# Altium schematic sheet Wavefolder.SchDoc
size B
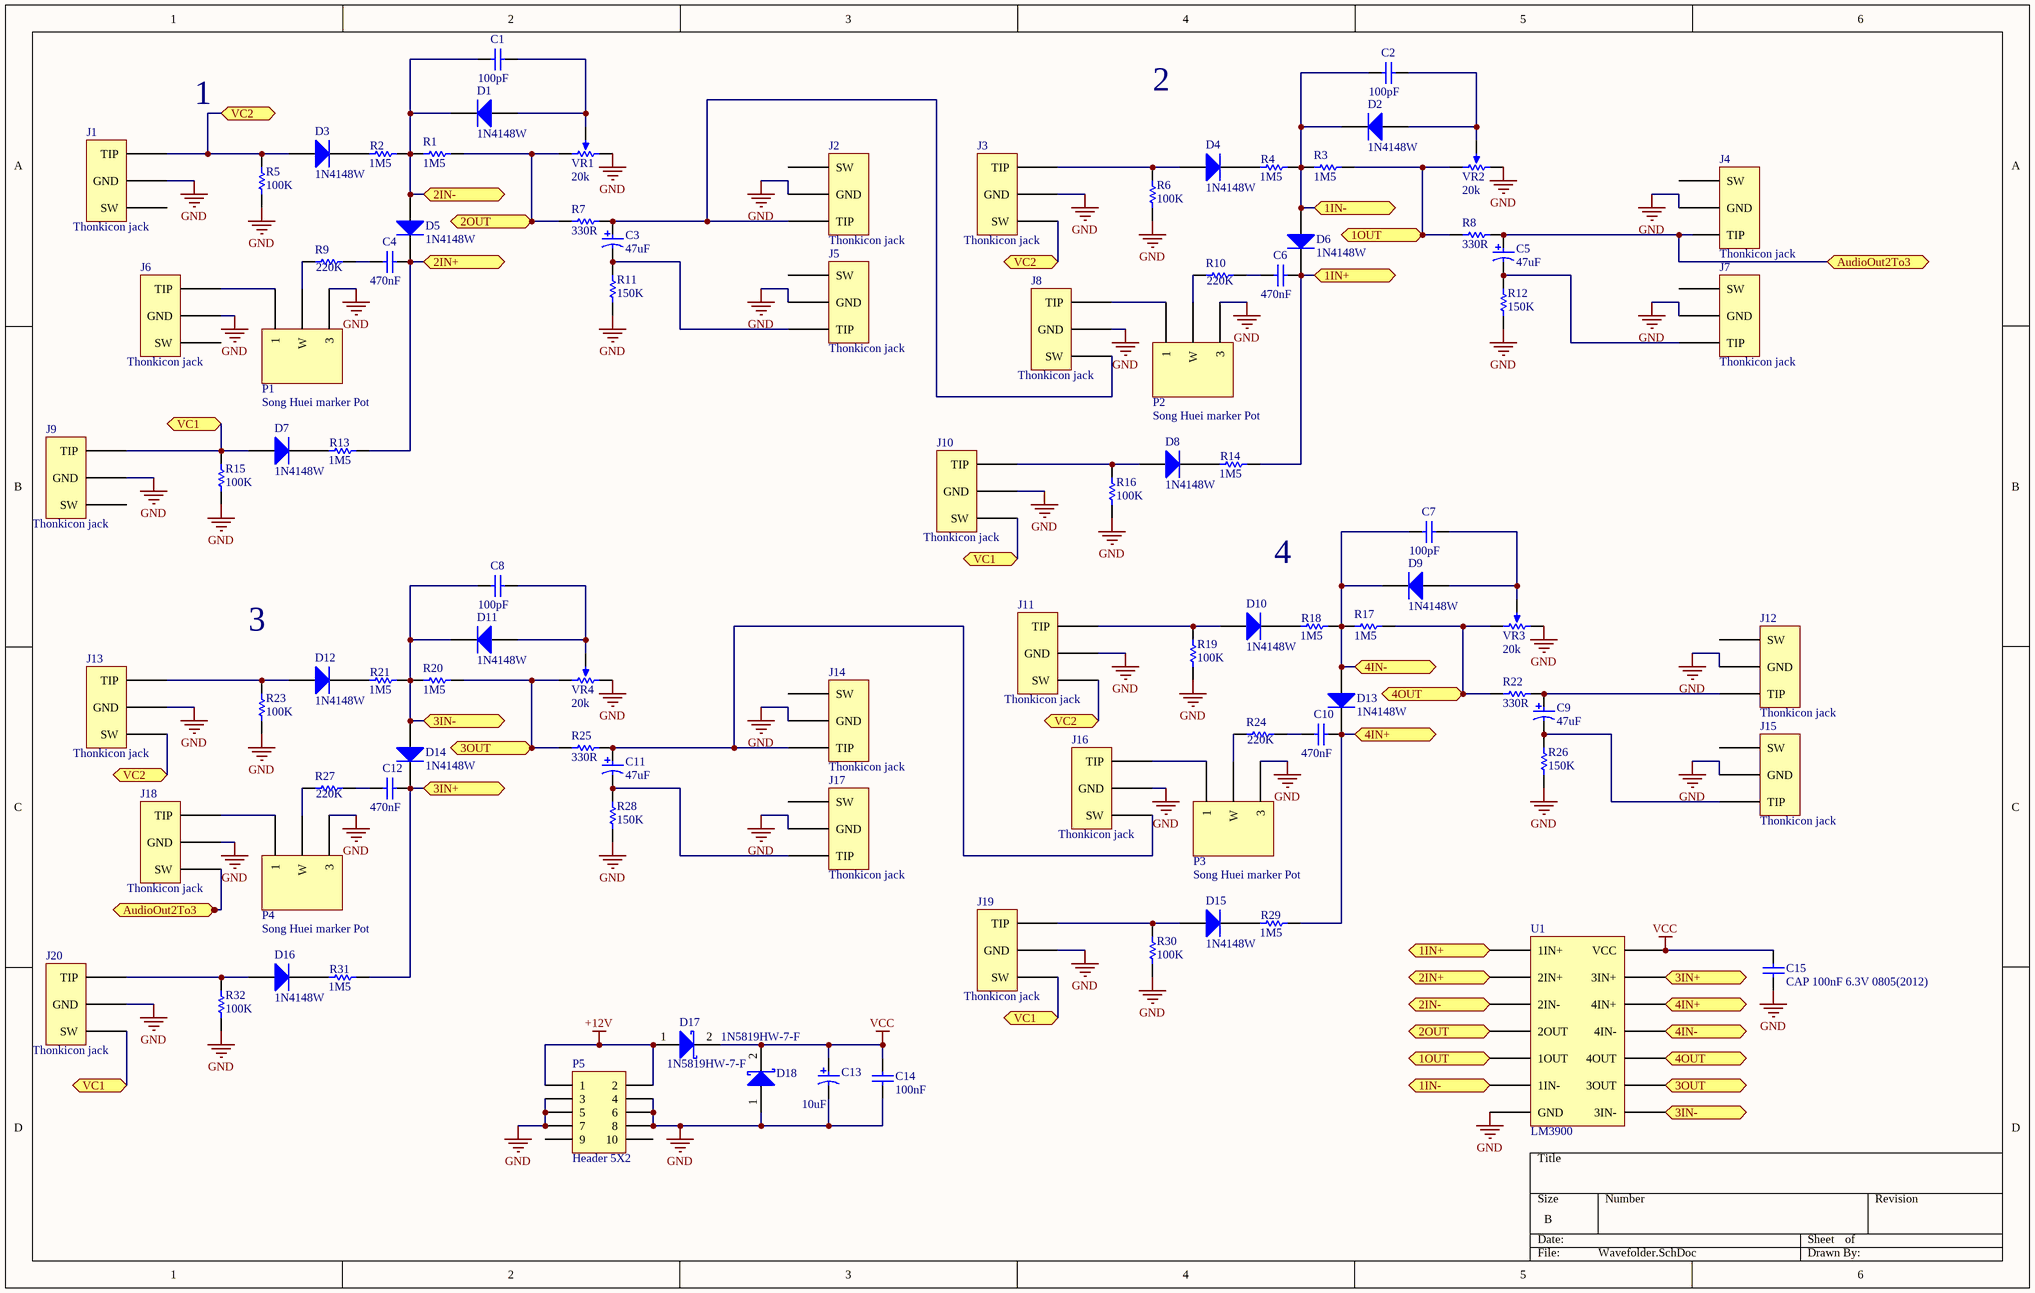
[diagram p0: Wavefolder.SchDoc]

## Parts
C1  100pF  [CAPC0805(2012)75_N]
C2  100pF  [CAPC0805(2012)75_N]
C3  47uF  [PNSC-FT-V-53x53-2_V]
C4  470nF  [CAPC0805(2012)75_N]
C5  47uF  [PNSC-FT-V-53x53-2_V]
C6  470nF  [CAPC0805(2012)75_N]
C7  100pF  [CAPC0805(2012)75_N]
C8  100pF  [CAPC0805(2012)75_N]
C9  47uF  [PNSC-FT-V-53x53-2_V]
C10  470nF  [CAPC0805(2012)75_N]
C11  47uF  [PNSC-FT-V-53x53-2_V]
C12  470nF  [CAPC0805(2012)75_N]
C13  10uF  [NIC-CAPA2-4X5.8_V]
C14  100nF  [CAPC0805(2012)75_N]
C15  CAP 100nF 6.3V 0805(2012)  [CAPC0805(2012)100_N]
D1  1N4148W  [JSCJ-SOD-123-2_V]
D2  1N4148W  [JSCJ-SOD-123-2_V]
D3  1N4148W  [JSCJ-SOD-123-2_V]
D4  1N4148W  [JSCJ-SOD-123-2_V]
D5  1N4148W  [JSCJ-SOD-123-2_V]
D6  1N4148W  [JSCJ-SOD-123-2_V]
D7  1N4148W  [JSCJ-SOD-123-2_V]
D8  1N4148W  [JSCJ-SOD-123-2_V]
D9  1N4148W  [JSCJ-SOD-123-2_V]
D10  1N4148W  [JSCJ-SOD-123-2_V]
D11  1N4148W  [JSCJ-SOD-123-2_V]
D12  1N4148W  [JSCJ-SOD-123-2_V]
D13  1N4148W  [JSCJ-SOD-123-2_V]
D14  1N4148W  [JSCJ-SOD-123-2_V]
D15  1N4148W  [JSCJ-SOD-123-2_V]
D16  1N4148W  [JSCJ-SOD-123-2_V]
D17  1N5819HW-7-F  [DIOD-SOD-123-2_V]
D18  1N5819HW-7-F  [DIOD-SOD-123-2_V]
J1  Thonkicon jack  [Thonkiconn Pot PJ301M]
J2  Thonkicon jack  [Thonkiconn Pot PJ301M]
J3  Thonkicon jack  [Thonkiconn Pot PJ301M]
J4  Thonkicon jack  [Thonkiconn Pot PJ301M]
J5  Thonkicon jack  [Thonkiconn Pot PJ301M]
J6  Thonkicon jack  [Thonkiconn Pot PJ301M]
J7  Thonkicon jack  [Thonkiconn Pot PJ301M]
J8  Thonkicon jack  [Thonkiconn Pot PJ301M]
J9  Thonkicon jack  [Thonkiconn Pot PJ301M]
J10  Thonkicon jack  [Thonkiconn Pot PJ301M]
J11  Thonkicon jack  [Thonkiconn Pot PJ301M]
J12  Thonkicon jack  [Thonkiconn Pot PJ301M]
J13  Thonkicon jack  [Thonkiconn Pot PJ301M]
J14  Thonkicon jack  [Thonkiconn Pot PJ301M]
J15  Thonkicon jack  [Thonkiconn Pot PJ301M]
J16  Thonkicon jack  [Thonkiconn Pot PJ301M]
J17  Thonkicon jack  [Thonkiconn Pot PJ301M]
J18  Thonkicon jack  [Thonkiconn Pot PJ301M]
J19  Thonkicon jack  [Thonkiconn Pot PJ301M]
J20  Thonkicon jack  [Thonkiconn Pot PJ301M]
P1  Song Huei marker Pot  [SonGueiPot]
P2  Song Huei marker Pot  [SonGueiPot]
P3  Song Huei marker Pot  [SonGueiPot]
P4  Song Huei marker Pot  [SonGueiPot]
P5  Header 5X2  [HDR2X5]
R1  1M5  [RESC0805(2012)_N]
R2  1M5  [RESC0805(2012)_N]
R3  1M5  [RESC0805(2012)_N]
R4  1M5  [RESC0805(2012)_N]
R5  100K  [RESC0805(2012)_L]
R6  100K  [RESC0805(2012)_L]
R7  330R  [RESC0805(2012)_L]
R8  330R  [RESC0805(2012)_L]
R9  220K  [RESC0805(2012)_N]
R10  220K  [RESC0805(2012)_N]
R11  150K  [RESC0805(2012)_N]
R12  150K  [RESC0805(2012)_N]
R13  1M5  [RESC0805(2012)_N]
R14  1M5  [RESC0805(2012)_N]
R15  100K  [RESC0805(2012)_L]
R16  100K  [RESC0805(2012)_L]
R17  1M5  [RESC0805(2012)_N]
R18  1M5  [RESC0805(2012)_N]
R19  100K  [RESC0805(2012)_L]
R20  1M5  [RESC0805(2012)_N]
R21  1M5  [RESC0805(2012)_N]
R22  330R  [RESC0805(2012)_L]
R23  100K  [RESC0805(2012)_L]
R24  220K  [RESC0805(2012)_N]
R25  330R  [RESC0805(2012)_L]
R26  150K  [RESC0805(2012)_N]
R27  220K  [RESC0805(2012)_N]
R28  150K  [RESC0805(2012)_N]
R29  1M5  [RESC0805(2012)_N]
R30  100K  [RESC0805(2012)_L]
R31  1M5  [RESC0805(2012)_N]
R32  100K  [RESC0805(2012)_L]
U1  LM3900  [LM3900]
VR1  20k  [BOUR-3006P-3_V]
VR2  20k  [BOUR-3006P-3_V]
VR3  20k  [BOUR-3006P-3_V]
VR4  20k  [BOUR-3006P-3_V]

## Ports
1IN+, 1IN-, 1OUT, 2IN+, 2IN-, 2OUT, 3IN+, 3IN-, 3OUT, 4IN+, 4IN-, 4OUT, AudioOut2To3, VC1, VC2

## Nets
+12V: D17.1(A) P5.1 P5.2
GND: C13.2 C14.1 C15.1 D18.1(A) J1.1(GND) J2.1(GND) J3.1(GND) J4.1(GND) J5.1(GND) J6.1(GND) J7.1(GND) J8.1(GND) J9.1(GND) J10.1(GND) J11.1(GND) J12.1(GND) J13.1(GND) J14.1(GND) J15.1(GND) J16.1(GND) J17.1(GND) J18.1(GND) J19.1(GND) J20.1(GND) P1.3 P2.3 P3.3 P4.3 P5.3 P5.4 P5.5 P5.6 P5.7 P5.8 R5.1 R6.1 R11.1 R12.1 R15.1 R16.1 R19.1 R23.1 R26.1 R28.1 R30.1 R32.1 U1.7(GND) VR1.3(CW) VR2.3(CW) VR3.3(CW) VR4.3(CW)
VCC: C13.1 C14.2 C15.2 D17.2(K) D18.2(K) U1.14(VCC)
1IN+: C6.2 D6.2(-) R14.2 U1.1(1IN+) ; port 1IN+
1IN-: C2.1 D2.2(-) D6.1(+) R3.1 R4.2 U1.6(1IN-) ; port 1IN-
1OUT: R3.2 R8.1 U1.5(1OUT) VR2.1(CCW) ; port 1OUT
2IN+: C4.2 D5.2(-) R13.2 U1.2(2IN+) ; port 2IN+
2IN-: C1.1 D1.2(-) D5.1(+) R1.1 R2.2 U1.3(2IN-) ; port 2IN-
2OUT: R1.2 R7.1 U1.4(2OUT) VR1.1(CCW) ; port 2OUT
3IN+: C12.2 D14.2(-) R31.2 U1.13(3IN+) ; port 3IN+
3IN-: C8.1 D11.2(-) D14.1(+) R20.1 R21.2 U1.8(3IN-) ; port 3IN-
3OUT: R20.2 R25.1 U1.9(3OUT) VR4.1(CCW) ; port 3OUT
4IN+: C10.2 D13.2(-) R29.2 U1.12(4IN+) ; port 4IN+
4IN-: C7.1 D9.2(-) D13.1(+) R17.1 R18.2 U1.11(4IN-) ; port 4IN-
4OUT: R17.2 R22.1 U1.10(4OUT) VR3.1(CCW) ; port 4OUT
AudioOut2To3: C5.1 J4.3(TIP) J18.2(SW) R8.2 ; port AudioOut2To3
VC1: D7.1(+) J9.3(TIP) J10.2(SW) J19.2(SW) J20.2(SW) R15.2 ; port VC1
VC2: D3.1(+) J1.3(TIP) J3.2(SW) J11.2(SW) J13.2(SW) R5.2 ; port VC2
NetC1_2: C1.2 D1.1(+) VR1.2(WIPER)
NetC2_2: C2.2 D2.1(+) VR2.2(WIPER)
NetC3_1: C3.1 J2.3(TIP) J8.2(SW) R7.2
NetC3_2: C3.2 J5.3(TIP) R11.2
NetC4_1: C4.1 R9.2
NetC5_2: C5.2 J7.3(TIP) R12.2
NetC6_1: C6.1 R10.2
NetC7_2: C7.2 D9.1(+) VR3.2(WIPER)
NetC8_2: C8.2 D11.1(+) VR4.2(WIPER)
NetC9_1: C9.1 J12.3(TIP) R22.2
NetC9_2: C9.2 J15.3(TIP) R26.2
NetC10_1: C10.1 R24.2
NetC11_1: C11.1 J14.3(TIP) J16.2(SW) R25.2
NetC11_2: C11.2 J17.3(TIP) R28.2
NetC12_1: C12.1 R27.2
NetD3_2: D3.2(-) R2.1
NetD4_1: D4.1(+) J3.3(TIP) R6.2
NetD4_2: D4.2(-) R4.1
NetD7_2: D7.2(-) R13.1
NetD8_1: D8.1(+) J10.3(TIP) R16.2
NetD8_2: D8.2(-) R14.1
NetD10_1: D10.1(+) J11.3(TIP) R19.2
NetD10_2: D10.2(-) R18.1
NetD12_1: D12.1(+) J13.3(TIP) R23.2
NetD12_2: D12.2(-) R21.1
NetD15_1: D15.1(+) J19.3(TIP) R30.2
NetD15_2: D15.2(-) R29.1
NetD16_1: D16.1(+) J20.3(TIP) R32.2
NetD16_2: D16.2(-) R31.1
NetJ6_3: J6.3(TIP) P1.1
NetJ8_3: J8.3(TIP) P2.1
NetJ16_3: J16.3(TIP) P3.1
NetJ18_3: J18.3(TIP) P4.1
NetP1_2: P1.2(W) R9.1
NetP2_2: P2.2(W) R10.1
NetP3_2: P3.2(W) R24.1
NetP4_2: P4.2(W) R27.1

Not connected (* = marked no-connect by the designer): J1 2(SW); J2 2(SW); J4 2(SW); J5 2(SW); J6 2(SW); J7 2(SW); J9 2(SW); J12 2(SW); J14 2(SW); J15 2(SW); J17 2(SW); P5 9 10

## Notes on the sheet
- 2
- 1
- 4
- 3

## Library data of the parts
C1 C2 C7 C8 = CMP-1036-00012-1: CAP 0.5pF 25V ±0.1pF 0805 (2012 Metric) Thickness 0.75mm SMD; Case-EIA: 0805; Case-Metric: 2012; Tolerance: Â±0.1pF; Rated Voltage: 25 V; Max Thickness: 0.75 mm; Value: 100pF; Technology: SMT
C3 C5 C9 C11 = CMP-0744-00003-1: Aluminum Electrolytic Capacitor, 47 uF +/- 20%, 25 V, -55 to 105 degC, 2-Pin 5.3 x 5.3 x 6.1 mm SMD, RoHS, Tape and Reel; PartNumber: EEE-FT1E470AR; Manufacturer: Panasonic; Ripple Current: 240 mA; Rated Voltage: 25 V; Capacitance Tolerance: +/- 20%; ComponentLink3Description: Package Specification; RoHS: TRUE; Cap.: 47 uF; PackageReference: FT-V-53x53-2; DatasheetVersion: Mar-14; Temp. Range: -55 to 105 degC; ComponentLink2URL: http://industrial.panasonic.com/www-data/pdf/ABA0000/ABA0000CE135.pdf; PackageDescription: 2-Pin SMD, Body 5.3 x 5.3 mm, Height 6.1 mm; ComponentLink3URL: http://industrial.panasonic.com/www-data/pdf/ABA0000/ABA0000PE248.pdf; Mounting Technology: Surface Mount; ComponentLink2Description: Datasheet; ComponentLink1URL: http://www.panasonic.com/industrial/electronic-components/; PackageVersion: Feb-14; Packing: Tape and Reel; ComponentLink1Description: Manufacturer URL
C4 C6 C10 C12 = CMP-1036-00012-1: CAP 0.5pF 25V ±0.1pF 0805 (2012 Metric) Thickness 0.75mm SMD; Value: 470n; Case-EIA: 0805; Case-Metric: 2012; Tolerance: Â±0.1pF; Rated Voltage: 25 V; Max Thickness: 0.75 mm; Technology: SMT
C13 = CMP-0687-00016-1: Aluminum Electrolytic Capacitor, UD Series, Low Impedance, 10 uF, 25 V, + / - 20%, -55 to 105 degC, Chip Type, 4 x 5.8 mm D x L, Pb-Free, Reel; Manufacturer: Nichicon; PartNumber: UUD1E100MCL1GS; Endurance Time: 2000 h; Packing: Dia382mm Reel; Rated Ripple Current (at 100kHz): 80 mA; Tolerance Rated Capacitance: -20 to 20%; Impedance: 1.8 Ohm; Rated Voltage: 25 V; ComponentLink3URL: http://products.nichicon.co.jp/en/pdf/XJA043/e-ud.pdf; ComponentLink1Description: Manufacturer URL; DatasheetVersion: 08/2012; ComponentLink3Description: Package Specification; ComponentLink2Description: Datasheet; ComponentLink2URL: http://products.nichicon.co.jp/en/pdf/XJA043/e-ud.pdf; ComponentLink1URL: http://www.nichicon.co.jp/; Length: 5.8 mm; RoHS: TRUE; Diameter: 4 mm; Rated Capacitance: 10 uF; Mounting Technology: Surface Mount; PackageDescription: 2-Pin Surface Mount Device, Diameter 4 mm, Height 5.8 mm, Pitch 3.6 mm; PackageReference: CAPAE-D4H5.8
C14 = CMP-1036-00012-1: CAP 0.5pF 25V ±0.1pF 0805 (2012 Metric) Thickness 0.75mm SMD; Value: 100pF; Case-EIA: 0805; Case-Metric: 2012; Tolerance: Â±0.1pF; Rated Voltage: 25 V; Max Thickness: 0.75 mm; Technology: SMT
C15 = CMP-1036-04391-1: CAP 100nF 6.3V ±10% 0805 (2012 Metric) Thickness 1mm SMD; Case-EIA: 0805; Case-Metric: 2012; Tolerance: Â±10%; Rated Voltage: 6.3 V; Technology: SMT; Value: 100nF; Max Thickness: 1 mm
D1-D16 = CMP-0914-00001-1: Fast Switching Diode, 75 V, 150 mA, 2-Pin 2.7 x 1.6 x 1.25 mm SMD, Tape and Reel; Manufacturer: Changjiang Electronics; TSTG (degC): -55 to 150; IR (uA): 1; VR (V): 75; VF (V): 1.25; PD (mW): 350; Trr (ns): 4; IO (mA): 150; Packing: Tape and Reel; ComponentLink2URL: http://www.cj-elec.com/txUpfile/20121613352740313.pdf; PackageReference: SOD-123-2; PackageVersion: Rev. A; DatasheetVersion: Rev. A; ComponentLink3Description: Package Specification; ComponentLink3URL: http://www.cj-elec.com/txUpfile/201412112231195145.pdf; ComponentLink1Description: Manufacturer URL; ComponentLink1URL: http://www.cj-elec.com/; PartNumber: 1N4148W; ComponentLink2Description: Datasheet; PackageDescription: 2-Pin SMD, Body 2.7 x 1.6 mm, Height 1.25 mm; Mounting Technology: Surface Mount
D17 D18 = CMP-0303-00003-1: 1.0 A Surface Mount Schottky Barrier Rectifier, 40 V, -65 to 125 degC, 2-Pin SOD-123 Package, RoHS, Tape and Reel; Manufacturer: Diodes Inc; @ VR (V): 40; @ Terminal Temperature TT (degC): 90; Maximum Average Rectified Current IO (A): 1; Total Capacitance CT (pF): 50; Peak Forward Surge Current IFSM (A): 25; Forward Voltage Drop VF (V): 0.45; VR (RMS) (V): 28; RoHS: TRUE; PartNumber: 1N5819HW-7-F; ComponentLink2URL: http://www.diodes.com/datasheets/ds30217.pdf; PackageDescription: 2-Pin SOD-123, Body 2.7 x 1.55 mm, Pitch 3.7 mm; @ IF (A): 1; Operating and Storage Temperature Range: -65 to 125 degC; ComponentLink1Description: Manufacturer URL; ComponentLink2Description: Datasheet; ComponentLink1URL: http://www.diodes.com/; Mounting Technology: Surface Mount; DatasheetVersion: Rev. 15-2; PackageReference: SOD-123-2; Maximum Reverse Current IR (uA): 50; Peak Repetitive Reverse Voltage VRRM (V): 40; Packing: Tape and Reel
P5 = Header 5X2: Header, 5-Pin, Dual row; LatestRevisionDate: 17-Jul-2002; LatestRevisionNote: Re-released for DXP Platform.; Publisher: Altium Limited
R1-R4 R13 R14 R17 R18 R20 R21 R29 R31 = CMP-1013-00150-1: 1M5 0.125W 5% 0805 (2012 Metric)  SMD; Value: 1500000.00 Ohm; Case-Metric: 2012; Case-EIA: 0805; Tolerance: 5 %; Technology: SMT; Power: 0.125 W
R5 R6 R15 R16 R19 R23 R30 R32 = CMP-1013-00122-1: 100K 0.125W 5% 0805 (2012 Metric)  SMD; Case-Metric: 2012; Value: 100000.00 Ohm; Case-EIA: 0805; Tolerance: 5 %; Technology: SMT; Power: 0.125 W
R7 R8 R22 R25 = CMP-1013-00062-1: 330R 0.125W 5% 0805 (2012 Metric)  SMD; Value: 330.00 Ohm; Case-EIA: 0805; Case-Metric: 2012; Tolerance: 5 %; Power: 0.125 W; Technology: SMT
R9 R10 R24 R27 = CMP-1013-00130-1: 220K 0.125W 5% 0805 (2012 Metric)  SMD; Case-Metric: 2012; Value: 220000.00 Ohm; Case-EIA: 0805; Tolerance: 5 %; Technology: SMT; Power: 0.125 W
R11 R12 R26 R28 = CMP-1013-00126-1: 150K 0.125W 5% 0805 (2012 Metric)  SMD; Value: 150000.00 Ohm; Case-EIA: 0805; Case-Metric: 2012; Technology: SMT; Power: 0.125 W; Tolerance: 5 %
VR1-VR4 = CMP-0972-00009-1: Trimming Potentiometer, 5K Ohm +/- 10%, -55 to 125 degC, 3-Pin 19.05 x 4.83 x 6.6 mm THD, Transparent Housing, RoHS; Manufacturer: Bourns; PartNumber: 3006P-7-502ZLF; Resistance (kOhm): 5; Resistance Tolerance: +/- 10%; Rotational Life: 200 Cycles; Number of Turns: 15; PackageDescription: 3-Pin THD, Body 19.05 x 4.83 mm, Height 6.6 mm; ComponentLink3Description: Package Specification; ComponentLink1URL: http://www.bourns.com/; PackageReference: 3006P-3; RoHS: TRUE; PackageVersion: Apr-14; Mounting Technology: Through Hole; ComponentLink3URL: http://www.bourns.com/data/global/pdfs/3006.pdf; ComponentLink1Description: Manufacturer URL; Temperature Range: -55 to 125 degC; DatasheetVersion: Apr-14; ComponentLink2Description: Datasheet; ComponentLink2URL: http://www.bourns.com/data/global/pdfs/3006.pdf